# Altium schematic sheet SPIInterface.SchDoc: SPI Interface
size Letter; Engineer: Nathan Petersen; DocumentNumber: 19; Revision: v1.2; SheetNumber: 19; SheetTotal: 25
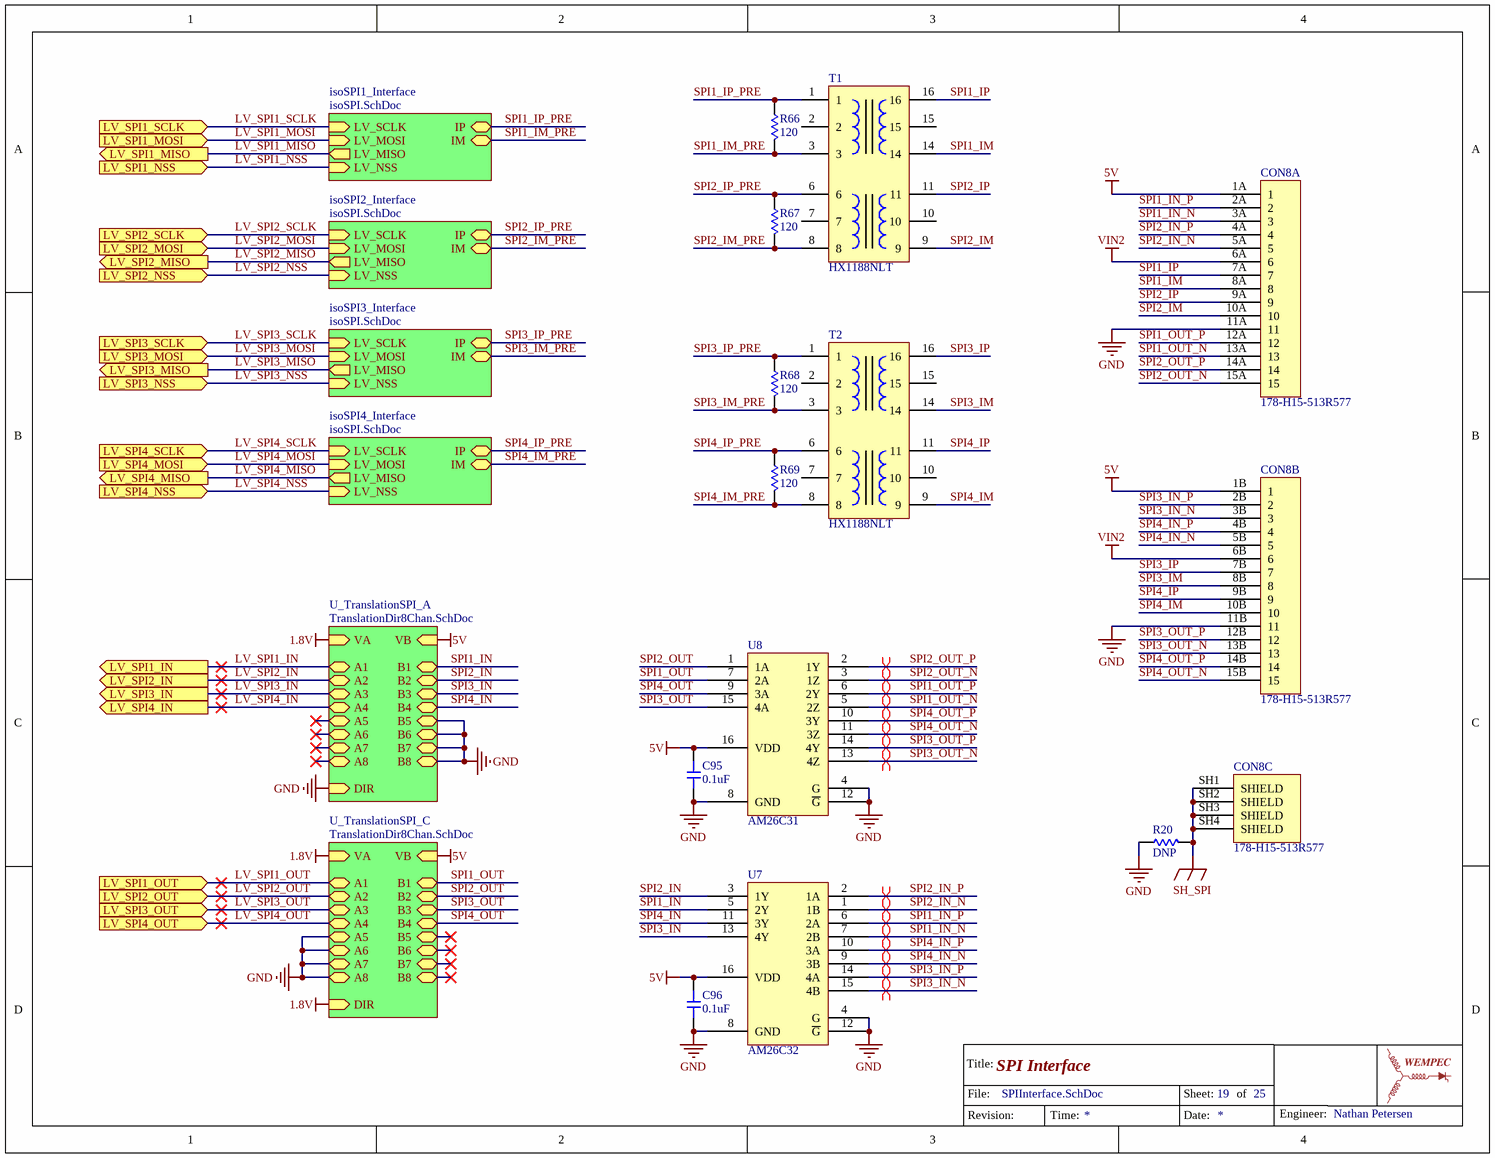
[diagram p0: SPIInterface.SchDoc]

## Parts
C95  value 0.1uF  [0603-CAP]  (hidden comment: Capacitor)
C96  value 0.1uF  [0603-CAP]  (hidden comment: Capacitor)
CON8  178-H15-513R577  [178-H15-513R577]  (parts A,B,C of 3)
R20  value DNP  [0603-RES]  (hidden comment: Resistor)
R66  value 120  [0603-RES]  (hidden comment: Resistor)
R67  value 120  [0603-RES]  (hidden comment: Resistor)
R68  value 120  [0603-RES]  (hidden comment: Resistor)
R69  value 120  [0603-RES]  (hidden comment: Resistor)
T1  HX1188NLT  [HX1188NLT]
T2  HX1188NLT  [HX1188NLT]
U7  AM26C32  [TSOP65P640X120-16N]
U8  AM26C31  [TSOP65P640X120-16N]

## Sub-sheets
isoSPI1_Interface = isoSPI.SchDoc: LV_MISO (out), IM (bidir), LV_SCLK (in), LV_NSS (in), LV_MOSI (in), IP (bidir)
isoSPI2_Interface = isoSPI.SchDoc: LV_MISO (out), IM (bidir), LV_SCLK (in), LV_NSS (in), LV_MOSI (in), IP (bidir)
isoSPI3_Interface = isoSPI.SchDoc: LV_MISO (out), IM (bidir), LV_SCLK (in), LV_NSS (in), LV_MOSI (in), IP (bidir)
isoSPI4_Interface = isoSPI.SchDoc: LV_MISO (out), IM (bidir), LV_SCLK (in), LV_NSS (in), LV_MOSI (in), IP (bidir)
U_TranslationSPI_A = TranslationDir8Chan.SchDoc: VB (in), VA (in), B1 (bidir), B2 (bidir), B3 (bidir), B4 (bidir), B5 (bidir), B6 (bidir), B7 (bidir), B8 (bidir), A1 (bidir), A2 (bidir), A3 (bidir), A4 (bidir), A5 (bidir), A6 (bidir), A7 (bidir), A8 (bidir), DIR (in)
U_TranslationSPI_C = TranslationDir8Chan.SchDoc: VB (in), VA (in), B1 (bidir), B2 (bidir), B3 (bidir), B4 (bidir), B5 (bidir), B6 (bidir), B7 (bidir), B8 (bidir), A1 (bidir), A2 (bidir), A3 (bidir), A4 (bidir), A5 (bidir), A6 (bidir), A7 (bidir), A8 (bidir), DIR (in)

## Ports
LV_SPI1_IN (out), LV_SPI1_MISO (out), LV_SPI1_MOSI (in), LV_SPI1_NSS (in), LV_SPI1_OUT (in), LV_SPI1_SCLK (in), LV_SPI2_IN (out), LV_SPI2_MISO (out), LV_SPI2_MOSI (in), LV_SPI2_NSS (in), LV_SPI2_OUT (in), LV_SPI2_SCLK (in), LV_SPI3_IN (out), LV_SPI3_MISO (out), LV_SPI3_MOSI (in), LV_SPI3_NSS (in), LV_SPI3_OUT (in), LV_SPI3_SCLK (in), LV_SPI4_IN (out), LV_SPI4_MISO (out), LV_SPI4_MOSI (in), LV_SPI4_NSS (in), LV_SPI4_OUT (in), LV_SPI4_SCLK (in)

## Nets
1.8V: sheet U_TranslationSPI_A/VA, sheet U_TranslationSPI_C/VA, sheet U_TranslationSPI_C/DIR
5V: C95.1 C96.1 CON8.1A(1) CON8.1B(1) U7.16(VDD) U8.16(VDD) ; sheet U_TranslationSPI_A/VB, sheet U_TranslationSPI_C/VB
GND: C95.2 C96.2 CON8.11A(11) CON8.11B(11) R20.1 U7.4(G) U7.8(GND) U7.12(~{G}) U8.4(G) U8.8(GND) U8.12(~{G}) ; sheet U_TranslationSPI_A/B5, sheet U_TranslationSPI_A/B6, sheet U_TranslationSPI_A/B7, sheet U_TranslationSPI_A/B8, sheet U_TranslationSPI_A/DIR, sheet U_TranslationSPI_C/A5, sheet U_TranslationSPI_C/A6, sheet U_TranslationSPI_C/A7, sheet U_TranslationSPI_C/A8
SH_SPI: CON8.SH1(SHIELD) CON8.SH2(SHIELD) CON8.SH3(SHIELD) CON8.SH4(SHIELD) R20.2
VIN2: CON8.6A(6) CON8.6B(6)
LV_SPI1_IN: port LV_SPI1_IN, sheet U_TranslationSPI_A/A1
LV_SPI1_MISO: port LV_SPI1_MISO, sheet isoSPI1_Interface/LV_MISO
LV_SPI1_MOSI: port LV_SPI1_MOSI, sheet isoSPI1_Interface/LV_MOSI
LV_SPI1_NSS: port LV_SPI1_NSS, sheet isoSPI1_Interface/LV_NSS
LV_SPI1_OUT: port LV_SPI1_OUT, sheet U_TranslationSPI_C/A1
LV_SPI1_SCLK: port LV_SPI1_SCLK, sheet isoSPI1_Interface/LV_SCLK
LV_SPI2_IN: port LV_SPI2_IN, sheet U_TranslationSPI_A/A2
LV_SPI2_MISO: port LV_SPI2_MISO, sheet isoSPI2_Interface/LV_MISO
LV_SPI2_MOSI: port LV_SPI2_MOSI, sheet isoSPI2_Interface/LV_MOSI
LV_SPI2_NSS: port LV_SPI2_NSS, sheet isoSPI2_Interface/LV_NSS
LV_SPI2_OUT: port LV_SPI2_OUT, sheet U_TranslationSPI_C/A2
LV_SPI2_SCLK: port LV_SPI2_SCLK, sheet isoSPI2_Interface/LV_SCLK
LV_SPI3_IN: port LV_SPI3_IN, sheet U_TranslationSPI_A/A3
LV_SPI3_MISO: port LV_SPI3_MISO, sheet isoSPI3_Interface/LV_MISO
LV_SPI3_MOSI: port LV_SPI3_MOSI, sheet isoSPI3_Interface/LV_MOSI
LV_SPI3_NSS: port LV_SPI3_NSS, sheet isoSPI3_Interface/LV_NSS
LV_SPI3_OUT: port LV_SPI3_OUT, sheet U_TranslationSPI_C/A3
LV_SPI3_SCLK: port LV_SPI3_SCLK, sheet isoSPI3_Interface/LV_SCLK
LV_SPI4_IN: port LV_SPI4_IN, sheet U_TranslationSPI_A/A4
LV_SPI4_MISO: port LV_SPI4_MISO, sheet isoSPI4_Interface/LV_MISO
LV_SPI4_MOSI: port LV_SPI4_MOSI, sheet isoSPI4_Interface/LV_MOSI
LV_SPI4_NSS: port LV_SPI4_NSS, sheet isoSPI4_Interface/LV_NSS
LV_SPI4_OUT: port LV_SPI4_OUT, sheet U_TranslationSPI_C/A4
LV_SPI4_SCLK: port LV_SPI4_SCLK, sheet isoSPI4_Interface/LV_SCLK
SPI1_IM: CON8.8A(8) T1.14
SPI1_IM_PRE: R66.2 T1.3 ; sheet isoSPI1_Interface/IM
SPI1_IN: U7.5(2Y) ; sheet U_TranslationSPI_A/B1
SPI1_IN_N: CON8.3A(3) U7.7(2B)
SPI1_IN_P: CON8.2A(2) U7.6(2A)
SPI1_IP: CON8.7A(7) T1.16
SPI1_IP_PRE: R66.1 T1.1 ; sheet isoSPI1_Interface/IP
SPI1_OUT: U8.7(2A) ; sheet U_TranslationSPI_C/B1
SPI1_OUT_N: CON8.13A(13) U8.5(2Z)
SPI1_OUT_P: CON8.12A(12) U8.6(2Y)
SPI2_IM: CON8.10A(10) T1.9
SPI2_IM_PRE: R67.2 T1.8 ; sheet isoSPI2_Interface/IM
SPI2_IN: U7.3(1Y) ; sheet U_TranslationSPI_A/B2
SPI2_IN_N: CON8.5A(5) U7.1(1B)
SPI2_IN_P: CON8.4A(4) U7.2(1A)
SPI2_IP: CON8.9A(9) T1.11
SPI2_IP_PRE: R67.1 T1.6 ; sheet isoSPI2_Interface/IP
SPI2_OUT: U8.1(1A) ; sheet U_TranslationSPI_C/B2
SPI2_OUT_N: CON8.15A(15) U8.3(1Z)
SPI2_OUT_P: CON8.14A(14) U8.2(1Y)
SPI3_IM: CON8.8B(8) T2.14
SPI3_IM_PRE: R68.2 T2.3 ; sheet isoSPI3_Interface/IM
SPI3_IN: U7.13(4Y) ; sheet U_TranslationSPI_A/B3
SPI3_IN_N: CON8.3B(3) U7.15(4B)
SPI3_IN_P: CON8.2B(2) U7.14(4A)
SPI3_IP: CON8.7B(7) T2.16
SPI3_IP_PRE: R68.1 T2.1 ; sheet isoSPI3_Interface/IP
SPI3_OUT: U8.15(4A) ; sheet U_TranslationSPI_C/B3
SPI3_OUT_N: CON8.13B(13) U8.13(4Z)
SPI3_OUT_P: CON8.12B(12) U8.14(4Y)
SPI4_IM: CON8.10B(10) T2.9
SPI4_IM_PRE: R69.2 T2.8 ; sheet isoSPI4_Interface/IM
SPI4_IN: U7.11(3Y) ; sheet U_TranslationSPI_A/B4
SPI4_IN_N: CON8.5B(5) U7.9(3B)
SPI4_IN_P: CON8.4B(4) U7.10(3A)
SPI4_IP: CON8.9B(9) T2.11
SPI4_IP_PRE: R69.1 T2.6 ; sheet isoSPI4_Interface/IP
SPI4_OUT: U8.9(3A) ; sheet U_TranslationSPI_C/B4
SPI4_OUT_N: CON8.15B(15) U8.11(3Z)
SPI4_OUT_P: CON8.14B(14) U8.10(3Y)

Not connected (* = marked no-connect by the designer): T1 2 7 10 15; T2 2 7 10 15

## Layout directives
differential pair: SPI1_IN_N, SPI1_IN_P, SPI1_OUT_N, SPI1_OUT_P, SPI2_IN_N, SPI2_IN_P, SPI2_OUT_N, SPI2_OUT_P, SPI3_IN_N, SPI3_IN_P, SPI3_OUT_N, SPI3_OUT_P, SPI4_IN_N, SPI4_IN_P, SPI4_OUT_N, SPI4_OUT_P

## Notes on the sheet
- Title:
- File:
- Sheet:
- of
- Revision:
- Time:
- Date:
- Engineer:

## Library data of the parts
CON8 = 178-H15-513R577: CONN D-SUB PLUG 15POS R/A SLDR; Supplier 1: Digi-Key; Supplier Part Number 1: NOR1831-ND
T1 T2 = HX1188NLT: XFRMR MAGNETIC 1PORT 1:1 10/100; Supplier 1: Digi-Key; Supplier Part Number 1: 553-1536-1-ND
U7 = AM26C32: IC RCVR RS422 QUAD DIFF 16TSSOP; Supplier 1: Digi-Key; Supplier Part Number 1: 296-30088-1-ND
U8 = AM26C31: IC DRIVER 4/0 16TSSOP; Supplier 1: Digi-Key; Supplier Part Number 1: 296-30087-1-ND
C95 C96 = Capacitor: Supplier 1: Digi-Key; Supplier Part Number 1: 1276-1012-6-ND
R20 R66-R69 = Resistor: Supplier 1: Digi-Key
  R20: Supplier Part Number 1: P0.0GDKR-ND
  R66-R69: Supplier Part Number 1: 311-120HRCT-ND